# Altium schematic sheet MCU.SchDoc
size A4; SheetNumber: 1; SheetTotal: 2
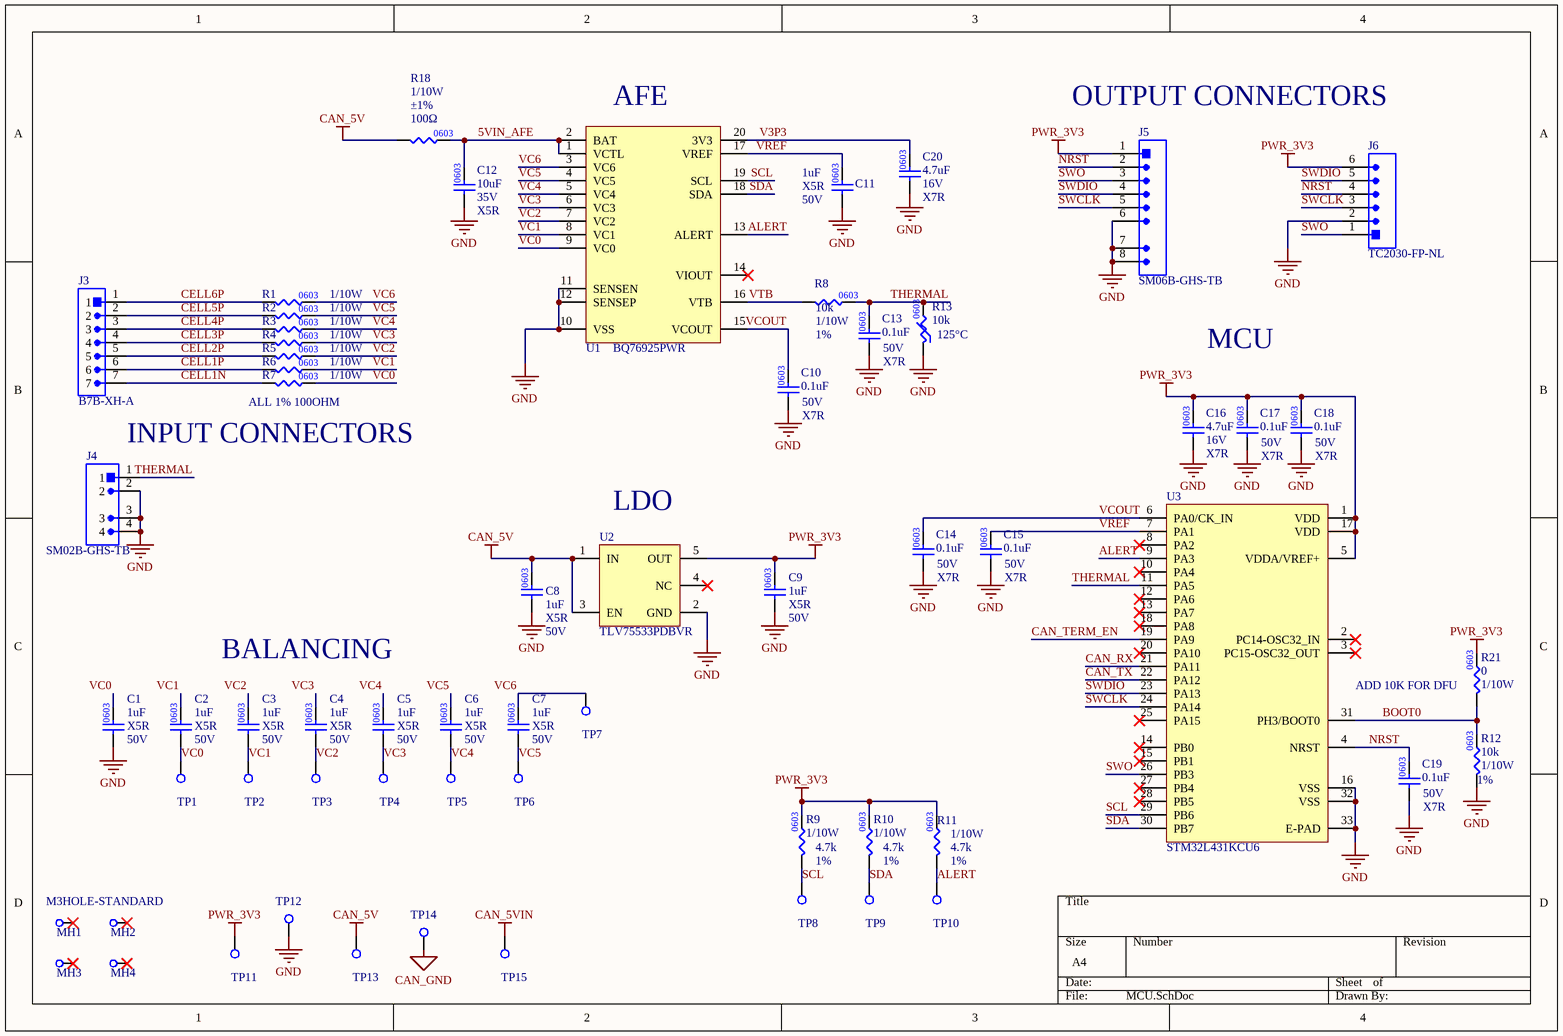
[diagram p0: MCU.SchDoc]

## Parts
C1  Dielectric: X5R  Voltage: 50V  Capacitance: 1uF  [.CAP_0603-Footprint-1]  (hidden comment: GRT188R61H105KE13D)
C2  Dielectric: X5R  Voltage: 50V  Capacitance: 1uF  [.CAP_0603-Footprint-1]  (hidden comment: GRT188R61H105KE13D)
C3  Dielectric: X5R  Voltage: 50V  Capacitance: 1uF  [.CAP_0603-Footprint-1]  (hidden comment: GRT188R61H105KE13D)
C4  Dielectric: X5R  Voltage: 50V  Capacitance: 1uF  [.CAP_0603-Footprint-1]  (hidden comment: GRT188R61H105KE13D)
C5  Dielectric: X5R  Voltage: 50V  Capacitance: 1uF  [.CAP_0603-Footprint-1]  (hidden comment: GRT188R61H105KE13D)
C6  Dielectric: X5R  Voltage: 50V  Capacitance: 1uF  [.CAP_0603-Footprint-1]  (hidden comment: GRT188R61H105KE13D)
C7  Dielectric: X5R  Voltage: 50V  Capacitance: 1uF  [.CAP_0603-Footprint-1]  (hidden comment: GRT188R61H105KE13D)
C8  Dielectric: X5R  Voltage: 50V  Capacitance: 1uF  [.CAP_0603-Footprint-1]  (hidden comment: GRT188R61H105KE13D)
C9  Dielectric: X5R  Voltage: 50V  Capacitance: 1uF  [.CAP_0603-Footprint-1]  (hidden comment: GRT188R61H105KE13D)
C10  value 0.1uF  Dielectric: X7R  Voltage: 50V  [.CAP_0603-Footprint-1]  (hidden comment: GCM188R71H104KA57D)
C11  Dielectric: X5R  Voltage: 50V  Capacitance: 1uF  [.CAP_0603-Footprint-1]  (hidden comment: GRT188R61H105KE13D)
C12  Capacitance: 10uF  Voltage: 35V  Temperature Coefficient: X5R  [.CAP_0603-Footprint-1]  (hidden comment: GRM188R6YA106MA73D)
C13  value 0.1uF  Dielectric: X7R  Voltage: 50V  [.CAP_0603-Footprint-1]  (hidden comment: GCM188R71H104KA57D)
C14  value 0.1uF  Dielectric: X7R  Voltage: 50V  [.CAP_0603-Footprint-1]  (hidden comment: GCM188R71H104KA57D)
C15  value 0.1uF  Dielectric: X7R  Voltage: 50V  [.CAP_0603-Footprint-1]  (hidden comment: GCM188R71H104KA57D)
C16  value 4.7uF  Voltage Rating: 16V  Temperature Coefficient: X7R  [.CAP_0603-Footprint-1]  (hidden comment: GRM188Z71C475KE21J)
C17  value 0.1uF  Dielectric: X7R  Voltage: 50V  [.CAP_0603-Footprint-1]  (hidden comment: GCM188R71H104KA57D)
C18  value 0.1uF  Dielectric: X7R  Voltage: 50V  [.CAP_0603-Footprint-1]  (hidden comment: GCM188R71H104KA57D)
C19  value 0.1uF  Dielectric: X7R  Voltage: 50V  [.CAP_0603-Footprint-1]  (hidden comment: GCM188R71H104KA57D)
C20  value 4.7uF  Voltage Rating: 16V  Temperature Coefficient: X7R  [.CAP_0603-Footprint-1]  (hidden comment: GRM188Z71C475KE21J)
J3  B7B-XH-A  [JST_B7B-XH-A]
J4  SM02B-GHS-TB  [SM02B-GHS-TB-Footprint-1]
J5  SM06B-GHS-TB  [SM06B-GHS-TB]
J6  TC2030-FP-NL  [TC2030-FP-NL]
MH1  M3HOLE-STANDARD  [M3HOLE-STANDARD-Footprint-1]
MH2  M3HOLE-STANDARD  [M3HOLE-STANDARD-Footprint-1]  (value not drawn)
MH3  M3HOLE-STANDARD  [M3HOLE-STANDARD-Footprint-1]  (value not drawn)
MH4  M3HOLE-STANDARD  [M3HOLE-STANDARD-Footprint-1]  (value not drawn)
R1  Power: 1/10W  [.RES_0603-Footprint-1]  (hidden comment: RC0603FR-07100RL)
R2  Power: 1/10W  [.RES_0603-Footprint-1]  (hidden comment: RC0603FR-07100RL)
R3  Power: 1/10W  [.RES_0603-Footprint-1]  (hidden comment: RC0603FR-07100RL)
R4  Power: 1/10W  [.RES_0603-Footprint-1]  (hidden comment: RC0603FR-07100RL)
R5  Power: 1/10W  [.RES_0603-Footprint-1]  (hidden comment: RC0603FR-07100RL)
R6  Power: 1/10W  [.RES_0603-Footprint-1]  (hidden comment: RC0603FR-07100RL)
R7  Power: 1/10W  [.RES_0603-Footprint-1]  (hidden comment: RC0603FR-07100RL)
R8  value 10k  Tolerance: 1%  Power: 1/10W  [.RES_0603-Footprint-1]  (hidden comment: RC0603FR-0710KL)
R9  Tolerance: 1%  Power: 1/10W  Resistance: 4.7k  [.RES_0603-Footprint-1]  (hidden comment: RC0603FR-074K7L)
R10  Tolerance: 1%  Power: 1/10W  Resistance: 4.7k  [.RES_0603-Footprint-1]  (hidden comment: RC0603FR-074K7L)
R11  Tolerance: 1%  Power: 1/10W  Resistance: 4.7k  [.RES_0603-Footprint-1]  (hidden comment: RC0603FR-074K7L)
R12  value 10k  Tolerance: 1%  Power: 1/10W  [.RES_0603-Footprint-1]  (hidden comment: RC0603FR-0710KL)
R13  value 10k  Max Operating Temperature: 125°C  [.RES_0603-Footprint-1]  (hidden comment: NTCG163JF103FT1)
R18  Resistance: 100Ω  Tolerance: ±1%  Power: 1/10W  [.RES_0603-Footprint-1]  (hidden comment: RC0603FR-07100RL)
R21  value 0  Power: 1/10W  [.RES_0603-Footprint-1]  (hidden comment: RC0603JR-070RL)
TP1  TESTINGPOINT_1MM  [TESTINGPOINT_1MM-Footprint-1]  (value not drawn)
TP2  TESTINGPOINT_1MM  [TESTINGPOINT_1MM-Footprint-1]  (value not drawn)
TP3  TESTINGPOINT_1MM  [TESTINGPOINT_1MM-Footprint-1]  (value not drawn)
TP4  TESTINGPOINT_1MM  [TESTINGPOINT_1MM-Footprint-1]  (value not drawn)
TP5  TESTINGPOINT_1MM  [TESTINGPOINT_1MM-Footprint-1]  (value not drawn)
TP6  TESTINGPOINT_1MM  [TESTINGPOINT_1MM-Footprint-1]  (value not drawn)
TP7  TESTINGPOINT_1MM  [TESTINGPOINT_1MM-Footprint-1]  (value not drawn)
TP8  TESTINGPOINT_1MM  [TESTINGPOINT_1MM-Footprint-1]  (value not drawn)
TP9  TESTINGPOINT_1MM  [TESTINGPOINT_1MM-Footprint-1]  (value not drawn)
TP10  TESTINGPOINT_1MM  [TESTINGPOINT_1MM-Footprint-1]  (value not drawn)
TP11  TESTINGPOINT_1MM  [TESTINGPOINT_1MM-Footprint-1]  (value not drawn)
TP12  TESTINGPOINT_1MM  [TESTINGPOINT_1MM-Footprint-1]  (value not drawn)
TP13  TESTINGPOINT_1MM  [TESTINGPOINT_1MM-Footprint-1]  (value not drawn)
TP14  TESTINGPOINT_1MM  [TESTINGPOINT_1MM-Footprint-1]  (value not drawn)
TP15  TESTINGPOINT_1MM  [TESTINGPOINT_1MM-Footprint-1]  (value not drawn)
U1  BQ76925PWR  [BQ76925PWR-Footprint-1]
U2  TLV75533PDBVR  [SOT-23-5]
U3  STM32L431KCU6  [STM32L431KCU6-Footprint-1]

## Nets
CAN_5V: C8.2 R18.1 TP13.1 U2.1(IN) U2.3(EN)
CAN_5VIN: TP15.1
CAN_GND: TP14.1
GND: C1.1 C8.1 C9.1 C10.1 C11.1 C12.1 C13.1 C14.1 C15.1 C16.1 C17.1 C18.1 C19.1 C20.1 J4.2 J4.3 J4.4 J5.6 J5.7 J5.8 J6.2 R12.1 R13.1 TP12.1 U1.10(VSS) U1.11(SENSEN) U1.12(SENSEP) U2.2(GND) U3.16(VSS) U3.32(VSS) U3.33(E-PAD)
PWR_3V3: C9.2 C16.2 C17.2 C18.2 J5.1 J6.6 R9.2 R10.2 R11.2 R21.2 TP11.1 U2.5(OUT) U3.1(VDD) U3.5(VDDA/VREF+) U3.17(VDD)
5VIN_AFE: C12.2 R18.2 U1.1(VCTL) U1.2(BAT)
ALERT: R11.1 TP10.1 U1.13(ALERT) U3.9(PA3)
BOOT0: R12.2 R21.1 U3.31(PH3/BOOT0)
CAN_RX: U3.21(PA11)
CAN_TERM_EN: U3.19(PA9)
CAN_TX: U3.22(PA12)
CELL1N: J3.7 R7.1
CELL1P: J3.6 R6.1
CELL2P: J3.5 R5.1
CELL3P: J3.4 R4.1
CELL4P: J3.3 R3.1
CELL5P: J3.2 R2.1
CELL6P: J3.1 R1.1
NRST: C19.2 J5.2 J6.4 U3.4(NRST)
SCL: R9.1 TP8.1 U1.19(SCL) U3.29(PB6)
SDA: R10.1 TP9.1 U1.18(SDA) U3.30(PB7)
SWCLK: J5.5 J6.3 U3.24(PA14)
SWDIO: J5.4 J6.5 U3.23(PA13)
SWO: J5.3 J6.1 U3.26(PB3)
THERMAL: C13.2 J4.1 R8.2 R13.2 U3.11(PA5)
V3P3: C20.2 U1.20(3V3)
VC0: C1.2 C2.1 R7.2 TP1.1 U1.9(VC0)
VC1: C2.2 C3.1 R6.2 TP2.1 U1.8(VC1)
VC2: C3.2 C4.1 R5.2 TP3.1 U1.7(VC2)
VC3: C4.2 C5.1 R4.2 TP4.1 U1.6(VC3)
VC4: C5.2 C6.1 R3.2 TP5.1 U1.5(VC4)
VC5: C6.2 C7.1 R2.2 TP6.1 U1.4(VC5)
VC6: C7.2 R1.2 TP7.1 U1.3(VC6)
VCOUT: C10.2 C14.2 U1.15(VCOUT) U3.6(PA0/CK_IN)
VREF: C11.2 C15.2 U1.17(VREF) U3.7(PA1)
VTB: R8.1 U1.16(VTB)

Not connected (* = marked no-connect by the designer): MH1 1*; MH2 1*; MH3 1*; MH4 1*; U1 14(VIOUT)*; U2 4(NC)*; U3 2(PC14-OSC32_IN)* 3(PC15-OSC32_OUT)* 8(PA2)* 10(PA4)* 12(PA6)* 13(PA7)* 14(PB0)* 15(PB1)* 18(PA8)* 20(PA10)* 25(PA15)* 27(PB4)* 28(PB5)*

## Notes on the sheet
- (near U1) AFE
- (near J5) OUTPUT CONNECTORS
- MCU
- INPUT CONNECTORS
- (near R7) ALL 1% 100OHM
- (near U2) LDO
- BALANCING
- ADD 10K FOR DFU
- (in symbol CMP-00449-4) 0603

## Library data of the parts
C1-C9 C11 = CMP-00096-4: CAP CER 1UF 50V X5R 0603; Package: 0603
C10 C13-C15 C17-C19 = CMP-00047-4: CAP CER 0.1uF 50V X7R 0603; Tolerance: 10%; Capacitance: 100nF; Case Code (Imperial): 0603; Mount: Surface Mount
C12 = CMP-00449-4: CAP CER 10UF 35V X5R 0603; Tolerance: ±20%
C16 C20 = CMP-00441-2: CAP CER 4.7UF 16V X7R 0603; Manufacturer 1: Murata Electronics; Capacitor Type: Ceramic; Mounting Technology: Surface Mount; Case/Package: 0603; Digikey Part Number 1: 490-GRM188Z71C475KE21JCT-ND; Manufacturer Part Number 1: GRM188Z71C475KE21J
J3 = CMP-113-000000-4: Connector Header Through Hole 7 position 0.098 (2.50mm); MF: JST Sales; Package: None; Design Item ID: B7B-XH-A; MP: B7B-XH-A; Pin Count: 7; Component Type: Standard; SnapEDA_Link: https://www.snapeda.com/parts/B7B-XH-A/JST+Sales+America+Inc./view-part/?ref=snap; Source: B7B-XH-A.SchLib; Value: *; Check_prices: https://www.snapeda.com/parts/B7B-XH-A/JST+Sales+America+Inc./view-part/?ref=eda
J4 = CMP-129-000035-2: CONN HEADER SMD R/A 2POS 1.25MM; Terminal Pitch: 1.25mm; Contact Gender: Male
J5 = CMP-00248-4: CONN HEADER SMD R/A 6POS 1.25MM; Current Rating: 1A; Rows: 1; Voltage: 50V; Positions: 6; Entry Type: R/A; Pitch: 1.25mm; Series: JST-GH
J6 = CMP-129-000024-1: For TC2030-CTX-NL-STDC14 for use with STM32 processors with STLINK-V3 /STLINK-V3MINI; Manufacturer: Tag-Connect; Pin Count: 10
MH1-MH4 = CMP-00005-4: Standard M3 Mounting hole as defined by mech team, see confluence for reasonning; Plating Diam: 6; Hole Diam: 3.4
R1-R7 = CMP-00022-4: RES 100 OHM 1% 1/10W 0603; Resistance: 100Ω; Package: 0603; Tolerance: ±1%
R8 R12 = CMP-009-00006-5: RES 10K OHM 1% 1/10W 0603; Resistance: 10k; Package: 0603
R9-R11 = CMP-00344-1: RES 4.7K OHM 1% 1/10W 0603; Package: 0603
R13 = CMP-00262-2: THERMISTOR NTC 10KOHM 3380K 0603; Tolerance: 1%; Case/Package: 0603; Min Operating Temperature: -40°C; Resistor Type: NTC THERMISTOR
R18 = CMP-00022-4: RES 100 OHM 1% 1/10W 0603; Package: 0603
R21 = CMP-009-00017-4: RES 0 OHM 1% 1/10W 0603; Resistance: 0Ω; Package: 0603; Tolerance: 1%
TP1-TP15 = CMP-00028-00002-2: Testing Point 1mm Radius; Radius: 1mm
U1 = CMP-00260-2: Power Supply Support Circuit, Adjustable, 1 Channel, PDSO20; Adjustable Threshold: Yes; Package Equivalence Code: TSSOP20,.25; Power Supplies: 4.2/26.4V; Max Supply Voltage: 26.4V; Min Supply Voltage: 4.2V; Supply Current-Max (Isup): 48uA; Number of Channels: 1; Package Body Material: Plastic; Qualification Status: Not Qualified; Nominal Supply Voltage: 21.6V; Throw Configuration: POWER SUPPLY SUPPORT CIRCUIT; Peak Reflow Temperature (Cel): 260°C; Max Operating Temperature: 85°C; Temperature Grade: OTHER; Reach SVHC Compliant: Yes; Moisture Sensitivity Level: 2; Height - Seated (Max): 1.2mm; Length: 6.5mm; Min Operating Temperature: -25°C; Package Shape: Rectangular; JESD-609 Code: e4; Pins: 20; Width: 4.4mm; Terminal Position: DUAL; Package Style: SMALL OUTLINE, THIN PROFILE, SHRINK PITCHMeter; Terminal Pitch: 0.65mm; Terminal Form: Gull Wing; JESD-30 Code: R-PDSO-G20; Surface Mount: Yes; Terminal Finish: Nickel; Channels: 1; Case/Package: TSSOP; RoHS Compliant: Yes
U2 = CMP-00225-6: IC REG LINEAR 3.3V 500MA SOT23-5; Output Voltage: 3.3 V; Current: 500mA
U3 = CMP-00224-6: IC MCU 32BIT 256KB FLSH 32UFQFPN